# Altium schematic sheet RGB_Matrix.SchDoc
size B
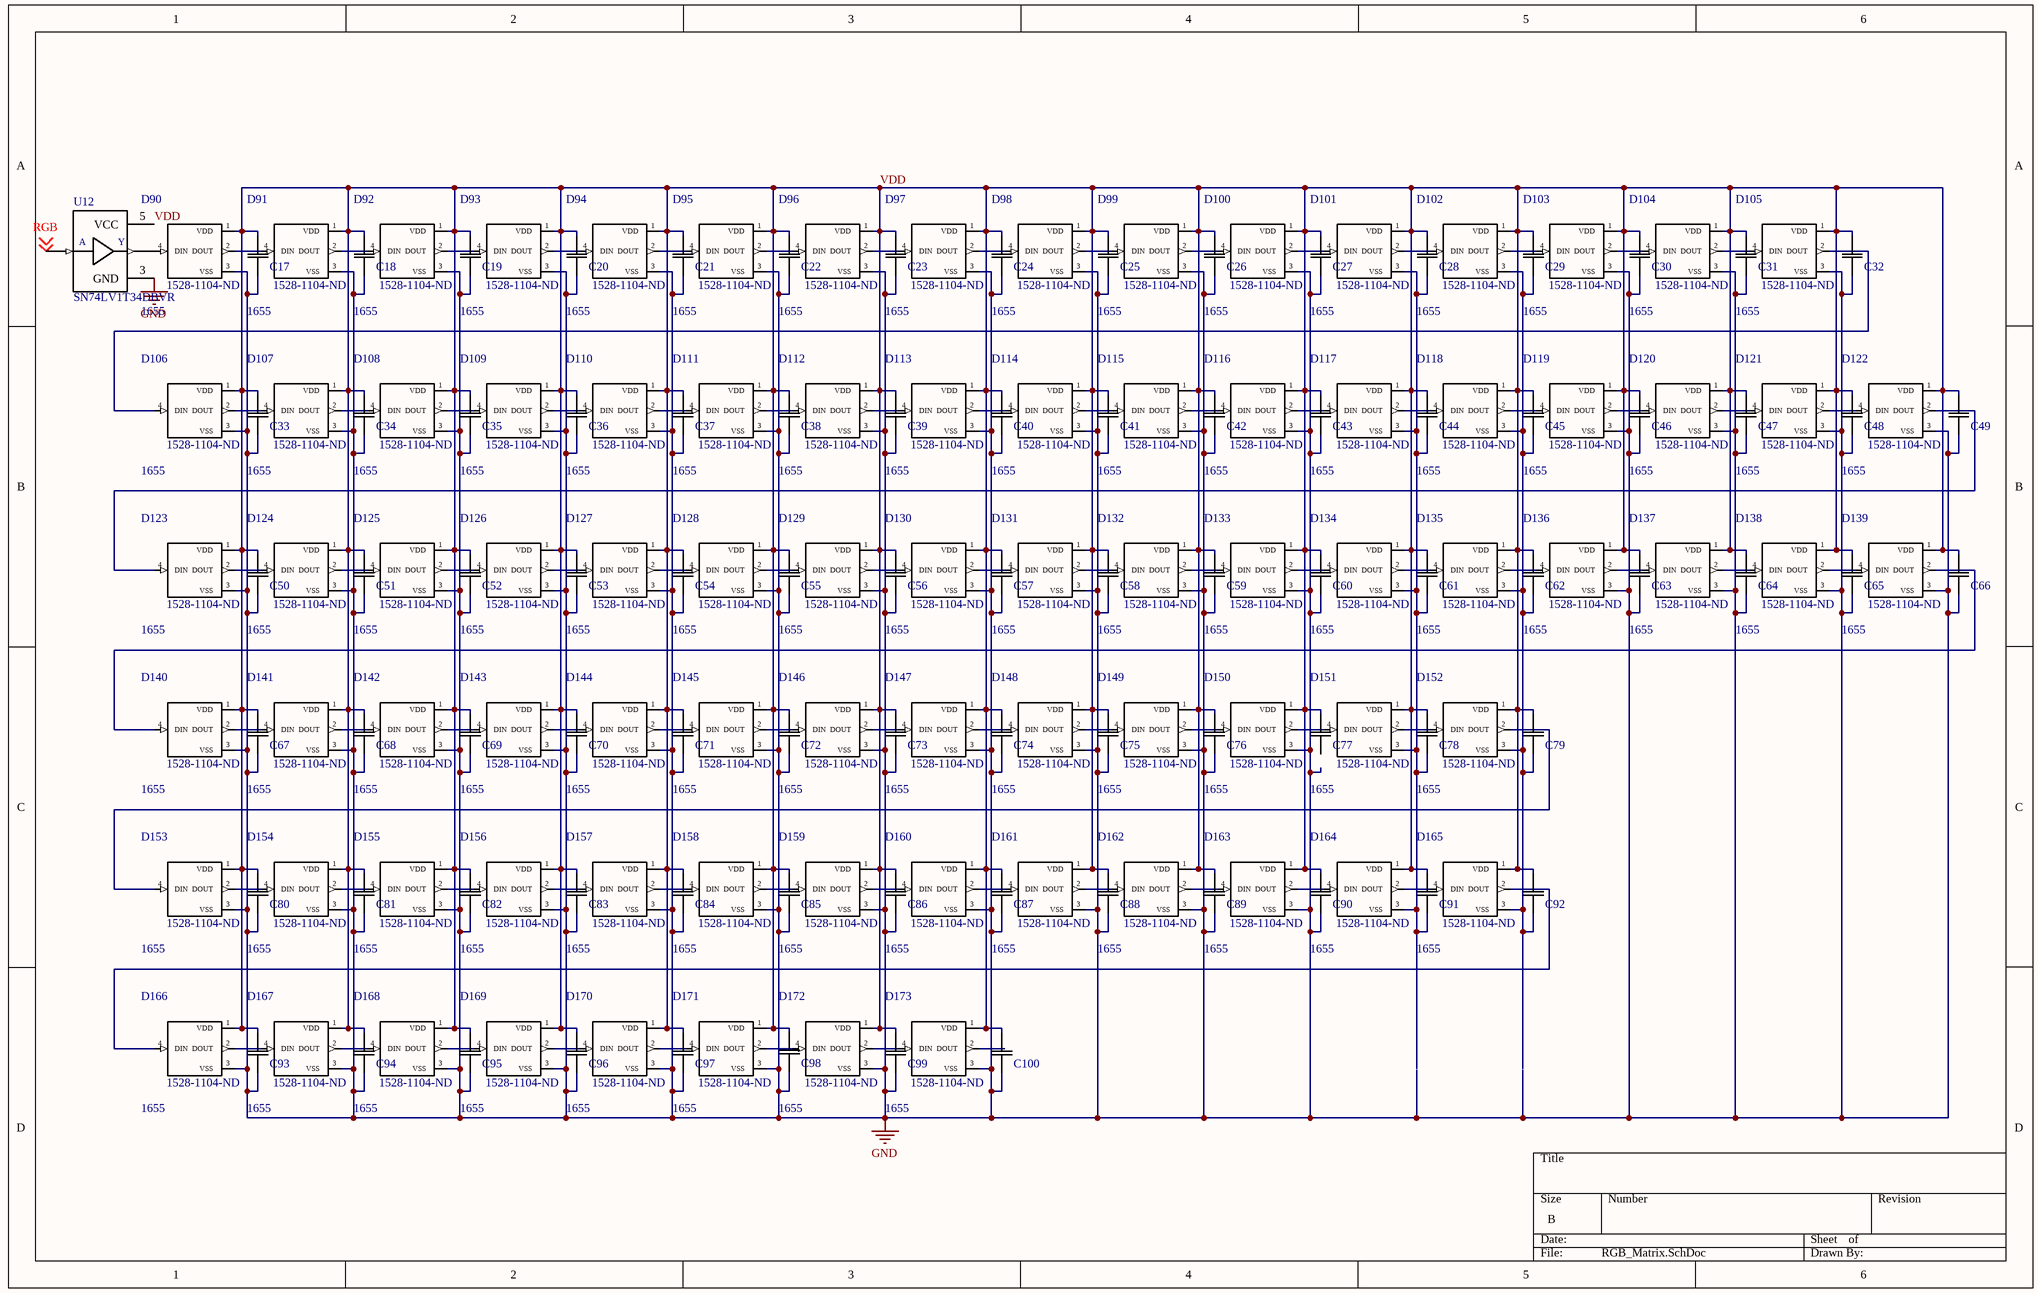
[diagram p0: RGB_Matrix.SchDoc]

## Parts
C17  Part Number: RCER71H104K0DBH03A  [RCER71H104K0DBH0]  (value not drawn)
C18  Part Number: RCER71H104K0DBH03A  [RCER71H104K0DBH0]  (value not drawn)
C19  Part Number: RCER71H104K0DBH03A  [RCER71H104K0DBH0]  (value not drawn)
C20  Part Number: RCER71H104K0DBH03A  [RCER71H104K0DBH0]  (value not drawn)
C21  Part Number: RCER71H104K0DBH03A  [RCER71H104K0DBH0]  (value not drawn)
C22  Part Number: RCER71H104K0DBH03A  [RCER71H104K0DBH0]  (value not drawn)
C23  Part Number: RCER71H104K0DBH03A  [RCER71H104K0DBH0]  (value not drawn)
C24  Part Number: RCER71H104K0DBH03A  [RCER71H104K0DBH0]  (value not drawn)
C25  Part Number: RCER71H104K0DBH03A  [RCER71H104K0DBH0]  (value not drawn)
C26  Part Number: RCER71H104K0DBH03A  [RCER71H104K0DBH0]  (value not drawn)
C27  Part Number: RCER71H104K0DBH03A  [RCER71H104K0DBH0]  (value not drawn)
C28  Part Number: RCER71H104K0DBH03A  [RCER71H104K0DBH0]  (value not drawn)
C29  Part Number: RCER71H104K0DBH03A  [RCER71H104K0DBH0]  (value not drawn)
C30  Part Number: RCER71H104K0DBH03A  [RCER71H104K0DBH0]  (value not drawn)
C31  Part Number: RCER71H104K0DBH03A  [RCER71H104K0DBH0]  (value not drawn)
C32  Part Number: RCER71H104K0DBH03A  [RCER71H104K0DBH0]  (value not drawn)
C33  Part Number: RCER71H104K0DBH03A  [RCER71H104K0DBH0]  (value not drawn)
C34  Part Number: RCER71H104K0DBH03A  [RCER71H104K0DBH0]  (value not drawn)
C35  Part Number: RCER71H104K0DBH03A  [RCER71H104K0DBH0]  (value not drawn)
C36  Part Number: RCER71H104K0DBH03A  [RCER71H104K0DBH0]  (value not drawn)
C37  Part Number: RCER71H104K0DBH03A  [RCER71H104K0DBH0]  (value not drawn)
C38  Part Number: RCER71H104K0DBH03A  [RCER71H104K0DBH0]  (value not drawn)
C39  Part Number: RCER71H104K0DBH03A  [RCER71H104K0DBH0]  (value not drawn)
C40  Part Number: RCER71H104K0DBH03A  [RCER71H104K0DBH0]  (value not drawn)
C41  Part Number: RCER71H104K0DBH03A  [RCER71H104K0DBH0]  (value not drawn)
C42  Part Number: RCER71H104K0DBH03A  [RCER71H104K0DBH0]  (value not drawn)
C43  Part Number: RCER71H104K0DBH03A  [RCER71H104K0DBH0]  (value not drawn)
C44  Part Number: RCER71H104K0DBH03A  [RCER71H104K0DBH0]  (value not drawn)
C45  Part Number: RCER71H104K0DBH03A  [RCER71H104K0DBH0]  (value not drawn)
C46  Part Number: RCER71H104K0DBH03A  [RCER71H104K0DBH0]  (value not drawn)
C47  Part Number: RCER71H104K0DBH03A  [RCER71H104K0DBH0]  (value not drawn)
C48  Part Number: RCER71H104K0DBH03A  [RCER71H104K0DBH0]  (value not drawn)
C49  Part Number: RCER71H104K0DBH03A  [RCER71H104K0DBH0]  (value not drawn)
C50  Part Number: RCER71H104K0DBH03A  [RCER71H104K0DBH0]  (value not drawn)
C51  Part Number: RCER71H104K0DBH03A  [RCER71H104K0DBH0]  (value not drawn)
C52  Part Number: RCER71H104K0DBH03A  [RCER71H104K0DBH0]  (value not drawn)
C53  Part Number: RCER71H104K0DBH03A  [RCER71H104K0DBH0]  (value not drawn)
C54  Part Number: RCER71H104K0DBH03A  [RCER71H104K0DBH0]  (value not drawn)
C55  Part Number: RCER71H104K0DBH03A  [RCER71H104K0DBH0]  (value not drawn)
C56  Part Number: RCER71H104K0DBH03A  [RCER71H104K0DBH0]  (value not drawn)
C57  Part Number: RCER71H104K0DBH03A  [RCER71H104K0DBH0]  (value not drawn)
C58  Part Number: RCER71H104K0DBH03A  [RCER71H104K0DBH0]  (value not drawn)
C59  Part Number: RCER71H104K0DBH03A  [RCER71H104K0DBH0]  (value not drawn)
C60  Part Number: RCER71H104K0DBH03A  [RCER71H104K0DBH0]  (value not drawn)
C61  Part Number: RCER71H104K0DBH03A  [RCER71H104K0DBH0]  (value not drawn)
C62  Part Number: RCER71H104K0DBH03A  [RCER71H104K0DBH0]  (value not drawn)
C63  Part Number: RCER71H104K0DBH03A  [RCER71H104K0DBH0]  (value not drawn)
C64  Part Number: RCER71H104K0DBH03A  [RCER71H104K0DBH0]  (value not drawn)
C65  Part Number: RCER71H104K0DBH03A  [RCER71H104K0DBH0]  (value not drawn)
C66  Part Number: RCER71H104K0DBH03A  [RCER71H104K0DBH0]  (value not drawn)
C67  Part Number: RCER71H104K0DBH03A  [RCER71H104K0DBH0]  (value not drawn)
C68  Part Number: RCER71H104K0DBH03A  [RCER71H104K0DBH0]  (value not drawn)
C69  Part Number: RCER71H104K0DBH03A  [RCER71H104K0DBH0]  (value not drawn)
C70  Part Number: RCER71H104K0DBH03A  [RCER71H104K0DBH0]  (value not drawn)
C71  Part Number: RCER71H104K0DBH03A  [RCER71H104K0DBH0]  (value not drawn)
C72  Part Number: RCER71H104K0DBH03A  [RCER71H104K0DBH0]  (value not drawn)
C73  Part Number: RCER71H104K0DBH03A  [RCER71H104K0DBH0]  (value not drawn)
C74  Part Number: RCER71H104K0DBH03A  [RCER71H104K0DBH0]  (value not drawn)
C75  Part Number: RCER71H104K0DBH03A  [RCER71H104K0DBH0]  (value not drawn)
C76  Part Number: RCER71H104K0DBH03A  [RCER71H104K0DBH0]  (value not drawn)
C77  Part Number: RCER71H104K0DBH03A  [RCER71H104K0DBH0]  (value not drawn)
C78  Part Number: RCER71H104K0DBH03A  [RCER71H104K0DBH0]  (value not drawn)
C79  Part Number: RCER71H104K0DBH03A  [RCER71H104K0DBH0]  (value not drawn)
C80  Part Number: RCER71H104K0DBH03A  [RCER71H104K0DBH0]  (value not drawn)
C81  Part Number: RCER71H104K0DBH03A  [RCER71H104K0DBH0]  (value not drawn)
C82  Part Number: RCER71H104K0DBH03A  [RCER71H104K0DBH0]  (value not drawn)
C83  Part Number: RCER71H104K0DBH03A  [RCER71H104K0DBH0]  (value not drawn)
C84  Part Number: RCER71H104K0DBH03A  [RCER71H104K0DBH0]  (value not drawn)
C85  Part Number: RCER71H104K0DBH03A  [RCER71H104K0DBH0]  (value not drawn)
C86  Part Number: RCER71H104K0DBH03A  [RCER71H104K0DBH0]  (value not drawn)
C87  Part Number: RCER71H104K0DBH03A  [RCER71H104K0DBH0]  (value not drawn)
C88  Part Number: RCER71H104K0DBH03A  [RCER71H104K0DBH0]  (value not drawn)
C89  Part Number: RCER71H104K0DBH03A  [RCER71H104K0DBH0]  (value not drawn)
C90  Part Number: RCER71H104K0DBH03A  [RCER71H104K0DBH0]  (value not drawn)
C91  Part Number: RCER71H104K0DBH03A  [RCER71H104K0DBH0]  (value not drawn)
C92  Part Number: RCER71H104K0DBH03A  [RCER71H104K0DBH0]  (value not drawn)
C93  Part Number: RCER71H104K0DBH03A  [RCER71H104K0DBH0]  (value not drawn)
C94  Part Number: RCER71H104K0DBH03A  [RCER71H104K0DBH0]  (value not drawn)
C95  Part Number: RCER71H104K0DBH03A  [RCER71H104K0DBH0]  (value not drawn)
C96  Part Number: RCER71H104K0DBH03A  [RCER71H104K0DBH0]  (value not drawn)
C97  Part Number: RCER71H104K0DBH03A  [RCER71H104K0DBH0]  (value not drawn)
C98  Part Number: RCER71H104K0DBH03A  [RCER71H104K0DBH0]  (value not drawn)
C99  Part Number: RCER71H104K0DBH03A  [RCER71H104K0DBH0]  (value not drawn)
C100  Part Number: RCER71H104K0DBH03A  [RCER71H104K0DBH0]  (value not drawn)
D90  1655  Supplier Part Number 1: 1528-1104-ND  [WS2182b_Underside]
D91  1655  Supplier Part Number 1: 1528-1104-ND  [WS2182b_Underside]
D92  1655  Supplier Part Number 1: 1528-1104-ND  [WS2182b_Underside]
D93  1655  Supplier Part Number 1: 1528-1104-ND  [WS2182b_Underside]
D94  1655  Supplier Part Number 1: 1528-1104-ND  [WS2182b_Underside]
D95  1655  Supplier Part Number 1: 1528-1104-ND  [WS2182b_Underside]
D96  1655  Supplier Part Number 1: 1528-1104-ND  [WS2182b_Underside]
D97  1655  Supplier Part Number 1: 1528-1104-ND  [WS2182b_Underside]
D98  1655  Supplier Part Number 1: 1528-1104-ND  [WS2182b_Underside]
D99  1655  Supplier Part Number 1: 1528-1104-ND  [WS2182b_Underside]
D100  1655  Supplier Part Number 1: 1528-1104-ND  [WS2182b_Underside]
D101  1655  Supplier Part Number 1: 1528-1104-ND  [WS2182b_Underside]
D102  1655  Supplier Part Number 1: 1528-1104-ND  [WS2182b_Underside]
D103  1655  Supplier Part Number 1: 1528-1104-ND  [WS2182b_Underside]
D104  1655  Supplier Part Number 1: 1528-1104-ND  [WS2182b_Underside]
D105  1655  Supplier Part Number 1: 1528-1104-ND  [WS2182b_Underside]
D106  1655  Supplier Part Number 1: 1528-1104-ND  [WS2182b_Underside]
D107  1655  Supplier Part Number 1: 1528-1104-ND  [WS2182b_Underside]
D108  1655  Supplier Part Number 1: 1528-1104-ND  [WS2182b_Underside]
D109  1655  Supplier Part Number 1: 1528-1104-ND  [WS2182b_Underside]
D110  1655  Supplier Part Number 1: 1528-1104-ND  [WS2182b_Underside]
D111  1655  Supplier Part Number 1: 1528-1104-ND  [WS2182b_Underside]
D112  1655  Supplier Part Number 1: 1528-1104-ND  [WS2182b_Underside]
D113  1655  Supplier Part Number 1: 1528-1104-ND  [WS2182b_Underside]
D114  1655  Supplier Part Number 1: 1528-1104-ND  [WS2182b_Underside]
D115  1655  Supplier Part Number 1: 1528-1104-ND  [WS2182b_Underside]
D116  1655  Supplier Part Number 1: 1528-1104-ND  [WS2182b_Underside]
D117  1655  Supplier Part Number 1: 1528-1104-ND  [WS2182b_Underside]
D118  1655  Supplier Part Number 1: 1528-1104-ND  [WS2182b_Underside]
D119  1655  Supplier Part Number 1: 1528-1104-ND  [WS2182b_Underside]
D120  1655  Supplier Part Number 1: 1528-1104-ND  [WS2182b_Underside]
D121  1655  Supplier Part Number 1: 1528-1104-ND  [WS2182b_Underside]
D122  1655  Supplier Part Number 1: 1528-1104-ND  [WS2182b_Underside]
D123  1655  Supplier Part Number 1: 1528-1104-ND  [WS2182b_Underside]
D124  1655  Supplier Part Number 1: 1528-1104-ND  [WS2182b_Underside]
D125  1655  Supplier Part Number 1: 1528-1104-ND  [WS2182b_Underside]
D126  1655  Supplier Part Number 1: 1528-1104-ND  [WS2182b_Underside]
D127  1655  Supplier Part Number 1: 1528-1104-ND  [WS2182b_Underside]
D128  1655  Supplier Part Number 1: 1528-1104-ND  [WS2182b_Underside]
D129  1655  Supplier Part Number 1: 1528-1104-ND  [WS2182b_Underside]
D130  1655  Supplier Part Number 1: 1528-1104-ND  [WS2182b_Underside]
D131  1655  Supplier Part Number 1: 1528-1104-ND  [WS2182b_Underside]
D132  1655  Supplier Part Number 1: 1528-1104-ND  [WS2182b_Underside]
D133  1655  Supplier Part Number 1: 1528-1104-ND  [WS2182b_Underside]
D134  1655  Supplier Part Number 1: 1528-1104-ND  [WS2182b_Underside]
D135  1655  Supplier Part Number 1: 1528-1104-ND  [WS2182b_Underside]
D136  1655  Supplier Part Number 1: 1528-1104-ND  [WS2182b_Underside]
D137  1655  Supplier Part Number 1: 1528-1104-ND  [WS2182b_Underside]
D138  1655  Supplier Part Number 1: 1528-1104-ND  [WS2182b_Underside]
D139  1655  Supplier Part Number 1: 1528-1104-ND  [WS2182b_Underside]
D140  1655  Supplier Part Number 1: 1528-1104-ND  [WS2182b_Underside]
D141  1655  Supplier Part Number 1: 1528-1104-ND  [WS2182b_Underside]
D142  1655  Supplier Part Number 1: 1528-1104-ND  [WS2182b_Underside]
D143  1655  Supplier Part Number 1: 1528-1104-ND  [WS2182b_Underside]
D144  1655  Supplier Part Number 1: 1528-1104-ND  [WS2182b_Underside]
D145  1655  Supplier Part Number 1: 1528-1104-ND  [WS2182b_Underside]
D146  1655  Supplier Part Number 1: 1528-1104-ND  [WS2182b_Underside]
D147  1655  Supplier Part Number 1: 1528-1104-ND  [WS2182b_Underside]
D148  1655  Supplier Part Number 1: 1528-1104-ND  [WS2182b_Underside]
D149  1655  Supplier Part Number 1: 1528-1104-ND  [WS2182b_Underside]
D150  1655  Supplier Part Number 1: 1528-1104-ND  [WS2182b_Underside]
D151  1655  Supplier Part Number 1: 1528-1104-ND  [WS2182b_Underside]
D152  1655  Supplier Part Number 1: 1528-1104-ND  [WS2182b_Underside]
D153  1655  Supplier Part Number 1: 1528-1104-ND  [WS2182b_Underside]
D154  1655  Supplier Part Number 1: 1528-1104-ND  [WS2182b_Underside]
D155  1655  Supplier Part Number 1: 1528-1104-ND  [WS2182b_Underside]
D156  1655  Supplier Part Number 1: 1528-1104-ND  [WS2182b_Underside]
D157  1655  Supplier Part Number 1: 1528-1104-ND  [WS2182b_Underside]
D158  1655  Supplier Part Number 1: 1528-1104-ND  [WS2182b_Underside]
D159  1655  Supplier Part Number 1: 1528-1104-ND  [WS2182b_Underside]
D160  1655  Supplier Part Number 1: 1528-1104-ND  [WS2182b_Underside]
D161  1655  Supplier Part Number 1: 1528-1104-ND  [WS2182b_Underside]
D162  1655  Supplier Part Number 1: 1528-1104-ND  [WS2182b_Underside]
D163  1655  Supplier Part Number 1: 1528-1104-ND  [WS2182b_Underside]
D164  1655  Supplier Part Number 1: 1528-1104-ND  [WS2182b_Underside]
D165  1655  Supplier Part Number 1: 1528-1104-ND  [WS2182b_Underside]
D166  1655  Supplier Part Number 1: 1528-1104-ND  [WS2182b_Underside]
D167  1655  Supplier Part Number 1: 1528-1104-ND  [WS2182b_Underside]
D168  1655  Supplier Part Number 1: 1528-1104-ND  [WS2182b_Underside]
D169  1655  Supplier Part Number 1: 1528-1104-ND  [WS2182b_Underside]
D170  1655  Supplier Part Number 1: 1528-1104-ND  [WS2182b_Underside]
D171  1655  Supplier Part Number 1: 1528-1104-ND  [WS2182b_Underside]
D172  1655  Supplier Part Number 1: 1528-1104-ND  [WS2182b_Underside]
D173  1655  Supplier Part Number 1: 1528-1104-ND  [WS2182b_Underside]
U12  SN74LV1T34DBVR  [SOT95P280X145-5N]

## Nets
GND: C17.2 C18.2 C19.2 C20.2 C21.2 C22.2 C23.2 C24.2 C25.2 C26.2 C27.2 C30.2 C31.2 C32.2 C33.2 C34.2 C35.2 C36.2 C37.2 C38.2 C39.2 C40.2 C41.2 C42.2 C43.2 C46.2 C47.2 C48.2 C49.2 C50.2 C51.2 C52.2 C53.2 C54.2 C55.2 C56.2 C57.2 C58.2 C59.2 C60.2 C63.2 C64.2 C65.2 C66.2 C67.2 C68.2 C69.2 C70.2 C71.2 C72.2 C73.2 C74.2 C75.2 C76.2 C80.2 C81.2 C82.2 C83.2 C84.2 C85.2 C86.2 C87.2 C88.2 C89.2 C90.2 C93.2 C94.2 C95.2 C96.2 C97.2 C98.2 C99.2 C100.2 D90.3(VSS) D91.3(VSS) D92.3(VSS) D93.3(VSS) D94.3(VSS) D95.3(VSS) D96.3(VSS) D97.3(VSS) D98.3(VSS) D99.3(VSS) D100.3(VSS) D103.3(VSS) D104.3(VSS) D105.3(VSS) D106.3(VSS) D107.3(VSS) D108.3(VSS) D109.3(VSS) D110.3(VSS) D111.3(VSS) D112.3(VSS) D113.3(VSS) D114.3(VSS) D115.3(VSS) D116.3(VSS) D119.3(VSS) D120.3(VSS) D121.3(VSS) D122.3(VSS) D123.3(VSS) D124.3(VSS) D125.3(VSS) D126.3(VSS) D127.3(VSS) D128.3(VSS) D129.3(VSS) D130.3(VSS) D131.3(VSS) D132.3(VSS) D133.3(VSS) D136.3(VSS) D137.3(VSS) D138.3(VSS) D139.3(VSS) D140.3(VSS) D141.3(VSS) D142.3(VSS) D143.3(VSS) D144.3(VSS) D145.3(VSS) D146.3(VSS) D147.3(VSS) D148.3(VSS) D149.3(VSS) D150.3(VSS) D153.3(VSS) D154.3(VSS) D155.3(VSS) D156.3(VSS) D157.3(VSS) D158.3(VSS) D159.3(VSS) D160.3(VSS) D161.3(VSS) D162.3(VSS) D163.3(VSS) D166.3(VSS) D167.3(VSS) D168.3(VSS) D169.3(VSS) D170.3(VSS) D171.3(VSS) D172.3(VSS) D173.3(VSS) U12.3(GND)
RGB: U12.2(A) ; off-sheet RGB
VDD: C17.1 C18.1 C19.1 C20.1 C21.1 C22.1 C23.1 C24.1 C25.1 C26.1 C27.1 C28.1 C29.1 C30.1 C31.1 C32.1 C33.1 C34.1 C35.1 C36.1 C37.1 C38.1 C39.1 C40.1 C41.1 C42.1 C43.1 C45.1 C46.1 C47.1 C48.1 C49.1 C50.1 C51.1 C52.1 C53.1 C54.1 C55.1 C56.1 C57.1 C58.1 C59.1 C60.1 C62.1 C63.1 C64.1 C65.1 C66.1 C67.1 C68.1 C69.1 C70.1 C71.1 C72.1 C73.1 C74.1 C75.1 C76.1 C77.1 C79.1 C80.1 C81.1 C82.1 C83.1 C84.1 C85.1 C86.1 C87.1 C88.1 C89.1 C90.1 C92.1 C93.1 C94.1 C95.1 C96.1 C97.1 C98.1 C99.1 C100.1 D90.1(VDD) D91.1(VDD) D92.1(VDD) D93.1(VDD) D94.1(VDD) D95.1(VDD) D96.1(VDD) D97.1(VDD) D98.1(VDD) D99.1(VDD) D100.1(VDD) D101.1(VDD) D102.1(VDD) D103.1(VDD) D104.1(VDD) D105.1(VDD) D106.1(VDD) D107.1(VDD) D108.1(VDD) D109.1(VDD) D110.1(VDD) D111.1(VDD) D112.1(VDD) D113.1(VDD) D114.1(VDD) D115.1(VDD) D116.1(VDD) D118.1(VDD) D119.1(VDD) D120.1(VDD) D121.1(VDD) D122.1(VDD) D123.1(VDD) D124.1(VDD) D125.1(VDD) D126.1(VDD) D127.1(VDD) D128.1(VDD) D129.1(VDD) D130.1(VDD) D131.1(VDD) D132.1(VDD) D133.1(VDD) D135.1(VDD) D136.1(VDD) D137.1(VDD) D138.1(VDD) D139.1(VDD) D140.1(VDD) D141.1(VDD) D142.1(VDD) D143.1(VDD) D144.1(VDD) D145.1(VDD) D146.1(VDD) D147.1(VDD) D148.1(VDD) D149.1(VDD) D150.1(VDD) D152.1(VDD) D153.1(VDD) D154.1(VDD) D155.1(VDD) D156.1(VDD) D157.1(VDD) D158.1(VDD) D159.1(VDD) D160.1(VDD) D161.1(VDD) D162.1(VDD) D163.1(VDD) D165.1(VDD) D166.1(VDD) D167.1(VDD) D168.1(VDD) D169.1(VDD) D170.1(VDD) D171.1(VDD) D172.1(VDD) D173.1(VDD) U12.5(VCC)
NetC28_2: C28.2 C44.2 C61.2 C78.2 C91.2 D101.3(VSS) D117.3(VSS) D134.3(VSS) D151.3(VSS) D164.3(VSS)
NetC29_2: C29.2 C45.2 C62.2 C79.2 C92.2 D102.3(VSS) D118.3(VSS) D135.3(VSS) D152.3(VSS) D165.3(VSS)
NetC44_1: C44.1 C61.1 C78.1 C91.1 D117.1(VDD) D134.1(VDD) D151.1(VDD) D164.1(VDD)
NetD90_2: D90.2(DOUT) D91.4(DIN)
NetD90_4: D90.4(DIN) U12.4(Y)
NetD91_2: D91.2(DOUT) D92.4(DIN)
NetD92_2: D92.2(DOUT) D93.4(DIN)
NetD93_2: D93.2(DOUT) D94.4(DIN)
NetD94_2: D94.2(DOUT) D95.4(DIN)
NetD95_2: D95.2(DOUT) D96.4(DIN)
NetD96_2: D96.2(DOUT) D97.4(DIN)
NetD97_2: D97.2(DOUT) D98.4(DIN)
NetD98_2: D98.2(DOUT) D99.4(DIN)
NetD99_2: D99.2(DOUT) D100.4(DIN)
NetD100_2: D100.2(DOUT) D101.4(DIN)
NetD101_2: D101.2(DOUT) D102.4(DIN)
NetD102_2: D102.2(DOUT) D103.4(DIN)
NetD103_2: D103.2(DOUT) D104.4(DIN)
NetD104_2: D104.2(DOUT) D105.4(DIN)
NetD105_2: D105.2(DOUT) D106.4(DIN)
NetD106_2: D106.2(DOUT) D107.4(DIN)
NetD107_2: D107.2(DOUT) D108.4(DIN)
NetD108_2: D108.2(DOUT) D109.4(DIN)
NetD109_2: D109.2(DOUT) D110.4(DIN)
NetD110_2: D110.2(DOUT) D111.4(DIN)
NetD111_2: D111.2(DOUT) D112.4(DIN)
NetD112_2: D112.2(DOUT) D113.4(DIN)
NetD113_2: D113.2(DOUT) D114.4(DIN)
NetD114_2: D114.2(DOUT) D115.4(DIN)
NetD115_2: D115.2(DOUT) D116.4(DIN)
NetD116_2: D116.2(DOUT) D117.4(DIN)
NetD117_2: D117.2(DOUT) D118.4(DIN)
NetD118_2: D118.2(DOUT) D119.4(DIN)
NetD119_2: D119.2(DOUT) D120.4(DIN)
NetD120_2: D120.2(DOUT) D121.4(DIN)
NetD121_2: D121.2(DOUT) D122.4(DIN)
NetD122_2: D122.2(DOUT) D123.4(DIN)
NetD123_2: D123.2(DOUT) D124.4(DIN)
NetD124_2: D124.2(DOUT) D125.4(DIN)
NetD125_2: D125.2(DOUT) D126.4(DIN)
NetD126_2: D126.2(DOUT) D127.4(DIN)
NetD127_2: D127.2(DOUT) D128.4(DIN)
NetD128_2: D128.2(DOUT) D129.4(DIN)
NetD129_2: D129.2(DOUT) D130.4(DIN)
NetD130_2: D130.2(DOUT) D131.4(DIN)
NetD131_2: D131.2(DOUT) D132.4(DIN)
NetD132_2: D132.2(DOUT) D133.4(DIN)
NetD133_2: D133.2(DOUT) D134.4(DIN)
NetD134_2: D134.2(DOUT) D135.4(DIN)
NetD135_2: D135.2(DOUT) D136.4(DIN)
NetD136_2: D136.2(DOUT) D137.4(DIN)
NetD137_2: D137.2(DOUT) D138.4(DIN)
NetD138_2: D138.2(DOUT) D139.4(DIN)
NetD139_2: D139.2(DOUT) D140.4(DIN)
NetD140_2: D140.2(DOUT) D141.4(DIN)
NetD141_2: D141.2(DOUT) D142.4(DIN)
NetD142_2: D142.2(DOUT) D143.4(DIN)
NetD143_2: D143.2(DOUT) D144.4(DIN)
NetD144_2: D144.2(DOUT) D145.4(DIN)
NetD145_2: D145.2(DOUT) D146.4(DIN)
NetD146_2: D146.2(DOUT) D147.4(DIN)
NetD147_2: D147.2(DOUT) D148.4(DIN)
NetD148_2: D148.2(DOUT) D149.4(DIN)
NetD149_2: D149.2(DOUT) D150.4(DIN)
NetD150_2: D150.2(DOUT) D151.4(DIN)
NetD151_2: D151.2(DOUT) D152.4(DIN)
NetD152_2: D152.2(DOUT) D153.4(DIN)
NetD153_2: D153.2(DOUT) D154.4(DIN)
NetD154_2: D154.2(DOUT) D155.4(DIN)
NetD155_2: D155.2(DOUT) D156.4(DIN)
NetD156_2: D156.2(DOUT) D157.4(DIN)
NetD157_2: D157.2(DOUT) D158.4(DIN)
NetD158_2: D158.2(DOUT) D159.4(DIN)
NetD159_2: D159.2(DOUT) D160.4(DIN)
NetD160_2: D160.2(DOUT) D161.4(DIN)
NetD161_2: D161.2(DOUT) D162.4(DIN)
NetD162_2: D162.2(DOUT) D163.4(DIN)
NetD163_2: D163.2(DOUT) D164.4(DIN)
NetD164_2: D164.2(DOUT) D165.4(DIN)
NetD165_2: D165.2(DOUT) D166.4(DIN)
NetD166_2: D166.2(DOUT) D167.4(DIN)
NetD167_2: D167.2(DOUT) D168.4(DIN)
NetD168_2: D168.2(DOUT) D169.4(DIN)
NetD169_2: D169.2(DOUT) D170.4(DIN)
NetD170_2: D170.2(DOUT) D171.4(DIN)
NetD171_2: D171.2(DOUT) D172.4(DIN)
NetD172_2: D172.2(DOUT) D173.4(DIN)

Not connected (* = marked no-connect by the designer): C77 2; D173 2(DOUT)

## Library data of the parts
C17-C100 = RCER71H104K0DBH0: No Description Available; Vendor: Murata; Copyright: Copyright (C) 2015 Accelerated Designs. All rights reserved; Manufacturer_Part_Number: RCER71H104K0DBH03A; Value: Value
D90-D173 = 1655: Ws2812b 5050 Rgb Led With Integrated Driver Chip Pack Of 10; MF: Adafruit; Availability: Good; MP: 1655; Price: 4.48 USD; SnapEDA_Link: https://www.snapeda.com/parts/1655/Adafruit%20Industries%20LLC/view-part/?ref=snap; Package: Adafruit; Value: *; Supplier 1: Digi-Key
U12 = SN74LV1T34DBVR: Single Power Supply BUFFER Logic Level Shifter _no enable_ 5-SOT-23 -40 to 125; MF: Texas Instruments; Availability: Unavailable; Price: None; Package: SOT-23 Texas Instruments; MP: SN74LV1T34DBVR; SnapEDA_Link: https://www.snapeda.com/parts/SN74LV1T34DBVR/Texas%20Instruments/view-part/?ref=snap; Value: *